# EAGLE design HTU21D Breakout-NoBigSilk (EAGLE 6.5.0)
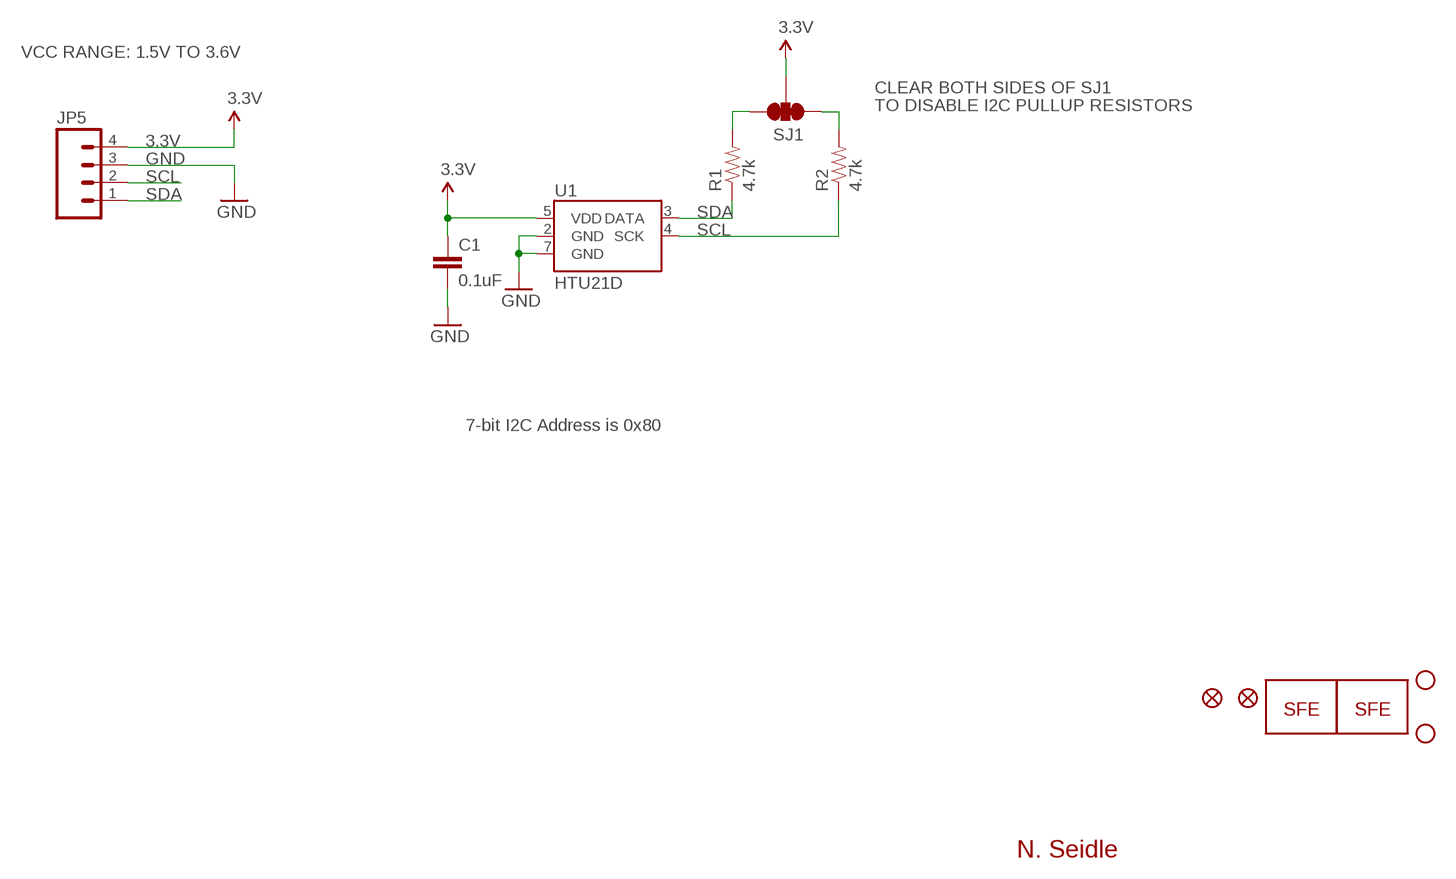
[diagram p0: schematic, sheet 1]

## Parts
C1  0.1uF  CAP0402-CAP  [0402-CAP]
JP2  LOGO-SFENW2  [SFE-NEW-WEB]
JP3  FIDUCIALUFIDUCIAL  [MICRO-FIDUCIAL]
JP4  FIDUCIALUFIDUCIAL  [MICRO-FIDUCIAL]
JP5  M04PTH  [1X04]
LOGO1  LOGO-SFESK  [SFE-LOGO-FLAME]
R1  4.7k  RESISTOR0402-RES  [0402-RES]
R2  4.7k  RESISTOR0402-RES  [0402-RES]
SJ1  SOLDERJUMPER_2WAYPASTE1&2&3  [SJ_3_PASTE1&2&3]
STANDOFF1  STAND-OFF  [STAND-OFF]
STANDOFF2  STAND-OFF  [STAND-OFF]
U1  HTU21D  HTU21DSMD  [HTU21D]

## Nets
3.3V: C1.1 JP5.4 SJ1.2 U1.5(VDD)
GND: C1.2 JP5.3 U1.2(GND) U1.7(GND)
N$1: R1.2 SJ1.3
N$2: R2.2 SJ1.1
SCL: JP5.2 R2.1 U1.4(SCK)
SDA: JP5.1 R1.1 U1.3(DATA)

## Notes on the sheet
- VCC RANGE: 1.5V TO 3.6V
- CLEAR BOTH SIDES OF SJ1
- TO DISABLE I2C PULLUP RESISTORS
- 7-bit I2C Address is 0x80
- N. Seidle

## Library data of the parts
C1 = SparkFun:CAP: Capacitor Standard 0603 ceramic capacitor, and 0.1" leaded capacitor.
JP2 = SparkFun-Aesthetics:LOGO-SFE: Spark Fun Electronics PCB Logo This is the standard Spark Fun Electronics PCB logo.
JP3 JP4 = SparkFun-Aesthetics:FIDUCIAL: Fiducial Alignment Points Various fiducial points for machine vision alignment.
JP5 = SparkFun-Connectors:M04: Header 4 Standard 4-pin 0.1" header. Use with straight break away headers (SKU : PRT-00116), right angle break away headers (PRT-00553), swiss pins (PRT-00743), machine pins (PRT-00117), and female headers (PRT-00115). Molex polarized connector foot print use with SKU : PRT-08231 with associated crimp pins and housings. 1MM SMD Version SKU: PRT-10208
LOGO1 = SparkFun:LOGO-SFE: Spark Fun Electronics PCB Logo This is the standard Spark Fun Electronics PCB logo.
R1 R2 = SparkFun:RESISTOR: Resistor Basic schematic elements and footprints for 0603, 1206, and PTH resistors.
SJ1 = mike-temp:SOLDERJUMPER_2WAY: Solder Jumper 2 way solder jumper
STANDOFF1 STANDOFF2 = SparkFun-Electromechanical:STAND-OFF: #4 Stand Off This is the mechanical footprint for a #4 phillips button head screw. Use the keepout ring to avoid running the screw head into surrounding components. SKU : PRT-00447
U1 = SparkFun-Sensors:HTU21D

## Board
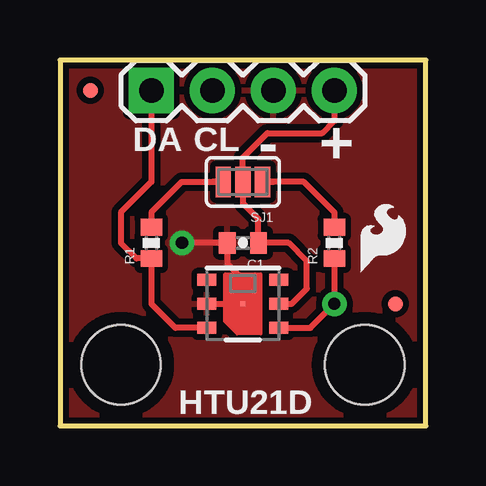
[diagram p1: board, top side]
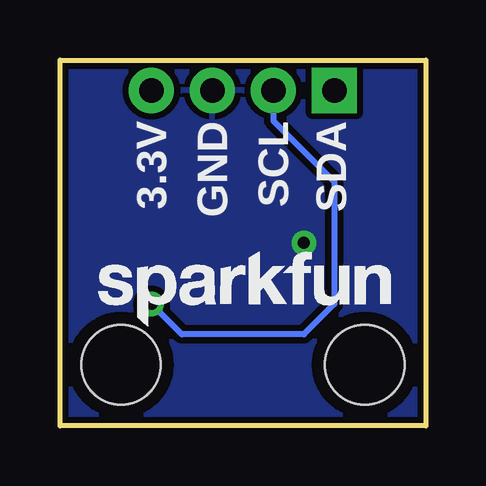
[diagram p2: board, bottom side, seen from below]

Size 15.24 x 15.24 mm. Coordinates in mm from the lower left corner, seen from the top.
Outline: 0,0 15.24,0 15.24,15.24 0,15.24 0,0
Copper layers (1*16): Top 0.035mm / dielectric 1.5mm / Bottom 0.035mm
Design rules "default": minimum track width 8mil, minimum drill 20mil, track to track 8mil, track to pad 8mil, pad to pad 8mil, via to via 8mil, smd to smd 8mil, copper to edge 8mil, drill to drill 8mil, minimum pad ring 12mil, minimum via ring 10mil, stop-mask expansion 4mil, vias tented up to drill 20mil, thermal gap 10mil

### Footprints (pad centres in the part's own frame; a part is rotated, then mirrored left to right if it is on the bottom)
0402-CAP = smd 0.7 x 0.9: 1 -0.65,0; 2 0.65,0
MICRO-FIDUCIAL = smd 0.635 x 0.635: 1 0,0
1X04 = drill 1.016 pad 1.88 square: 1 0,0 | drill 1.016 pad 1.88: 2 2.54,0; 3 5.08,0; 4 7.62,0
0402-RES = smd 0.7 x 0.9: 1 -0.65,0; 2 0.65,0
SJ_3_PASTE1&2&3 = smd 0.635 x 1.27: 1 -0.813,0; 2 0,0; 3 0.813,0
STAND-OFF = hole 3.302: 0,0
HTU21D = smd 0.8 x 0.5: 1 -1.5,1; 2 -1.5,0; 3 -1.5,-1; 4 1.5,-1; 5 1.5,0; 6 1.5,1 | smd 0.2 x 0.2: 7 0,0

### Placement (x,y rotation side)
C1  7.62,7.62 180 top
JP2  13.65,4.13 0 bottom
JP3  1.27,13.97 0 top
JP4  13.97,5.08 0 top
JP5  3.81,13.97 0 top
LOGO1  12.54,6.41 0 top
R1  3.81,7.62 90 top
R2  11.43,7.62 90 top
SJ1  7.62,10.16 180 top
STANDOFF1  12.7,2.54 0 top
STANDOFF2  2.54,2.54 0 top
U1  7.62,5.08 0 top

### Tracks (layer width: path | path; a pad name or v marks a point on that pad's centre or on a via)
3.3V
  Top 0.254: U1.5 9.65,5.08 10.29,5.71 10.29,6.86 9.53,7.62 C1.1 8.27,8.62 7.62,9.27 SJ1.2 7.62,11.18 8.64,12.19 10.92,12.19 11.43,12.7 JP5.4
GND  (via drill 0.51)
  Top 0.254: U1.2 U1.7 7.62,6.1 6.97,6.75 C1.2 v5.08,7.62
  pour Top (isolate 0.254): 0,15.24 0,0 15.24,0 15.24,15.24
  pour Bottom (isolate 0.254): 0,15.24 0,0 15.24,0 15.24,15.24
N$1
  Top 0.254: 6.35,10.16 SJ1.3 5.08,10.16 3.81,8.89 R1.2
N$2
  Top 0.254: 8.89,10.16 SJ1.1 10.16,10.16 11.43,8.89 R2.2
SCL  (via drill 0.51)
  Top 0.254: U1.4 10.43,4.08 v11.43,5.08 R2.1
  Bottom 0.254: JP5.2 6.35,12.7 3.81,10.16 3.81,5.08 5.08,3.81 10.16,3.81 v11.43,5.08
SDA
  Top 0.254: U1.3 4.81,4.08 3.81,5.08 R1.1 3.19,6.97 2.54,7.62 2.54,8.89 3.81,10.16 JP5.1

### Text on the board
tPlace: DA | CL | - | + | HTU21D
bPlace: SDA | SCL | GND | 3.3V